# Altium schematic sheet voltage_sense.SchDoc
size A4; Author: Mikołaj Pichita; CompanyName: AGH University of Science and Technology; SheetNumber: 14; SheetTotal: 16
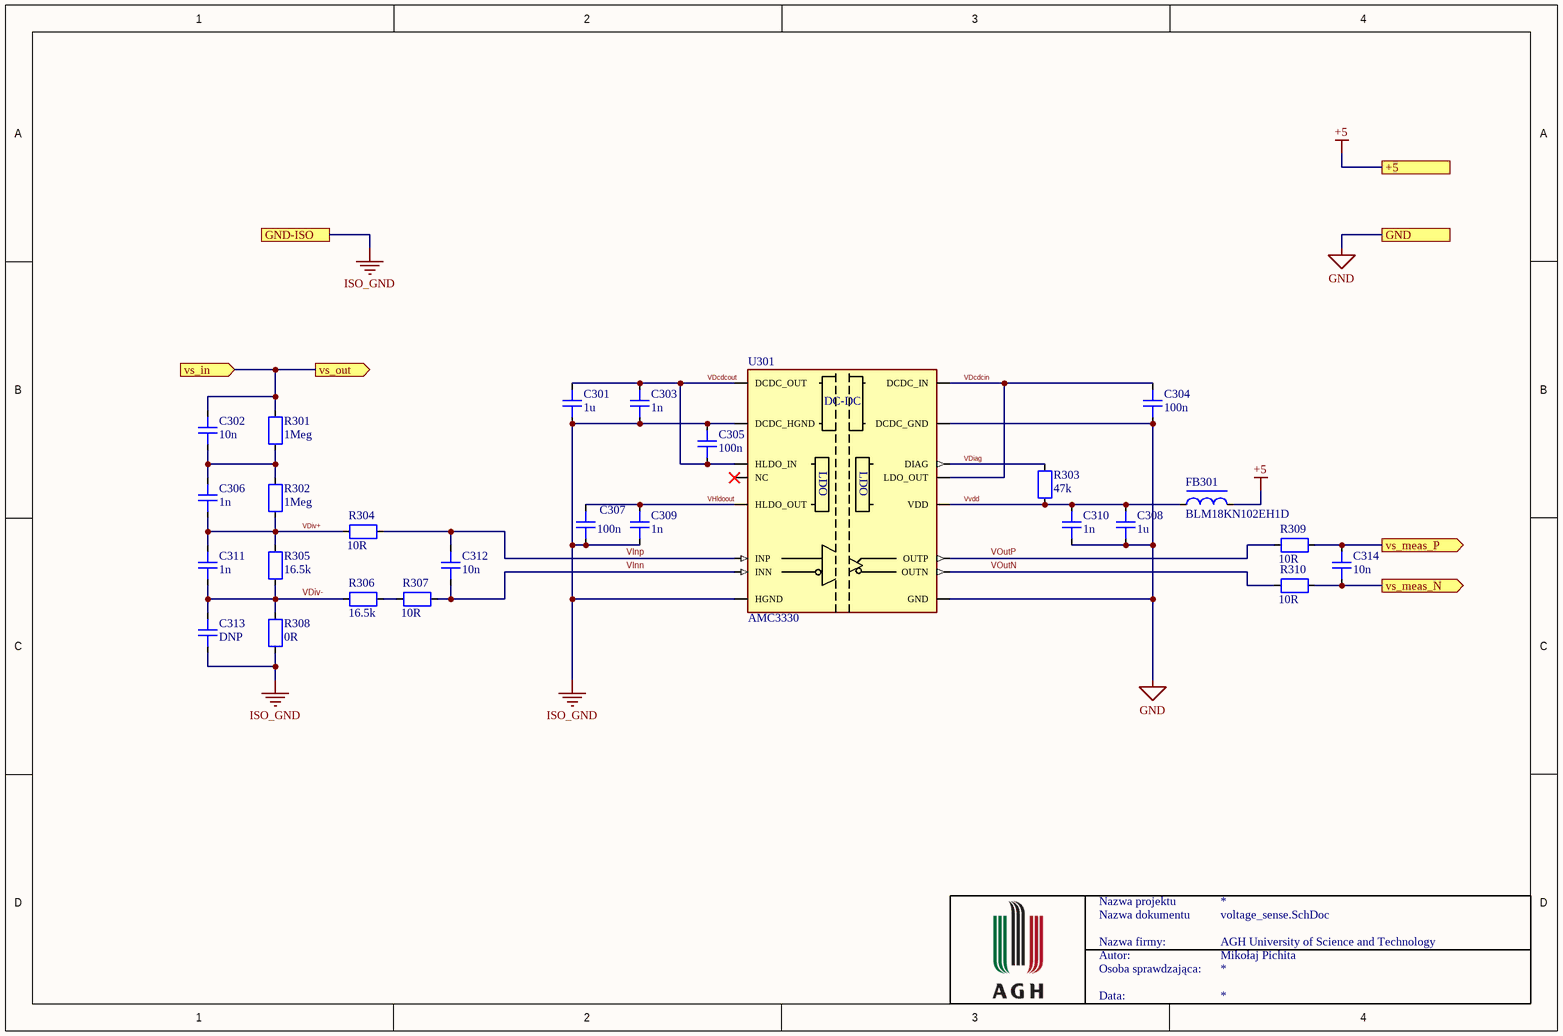
[diagram p0: voltage_sense.SchDoc]

## Parts
C301  1u  [CAP1206]
C302  10n  [CAP0603]
C303  1n  [CAP0603]
C304  100n  [CAP0603]
C305  100n  [CAP0603]
C306  1n  [CAP0603]
C307  100n  [CAP0603]
C308  1u  [CAP1206]
C309  1n  [CAP0603]
C310  1n  [CAP1206]
C311  1n  [CAP0603]
C312  10n  [CAP0603]
C313  DNP  [CAP0603]  (no BOM)
C314  10n  [CAP0603]
FB301  BLM18KN102EH1D  [RES0603]
R301  1Meg  [RES0603]
R302  1Meg  [RES0603]
R303  47k  [RES0603]
R304  10R  [RES0603]
R305  16.5k  [RES0603]
R306  16.5k  [RES0603]
R307  10R  [RES0603]
R308  0R  [RES0603]
R309  10R  [RES0603]
R310  10R  [RES0603]
U301  AMC3330  [SOIC127P1030X265-16N]

## Ports
+5 (see measurements[2C], choke_current_meas[4B], current_sense_shunt[4A], full_bridge[1C], isolator[1B], measurements[1C], microcontroller[1C], power_supply[2B]), GND (see measurements[2C], choke_current_meas[4B], current_sense_shunt[4A], full_bridge[1D], isolator[1B], measurements[1C], microcontroller[1C], power_supply[1B]), GND-ISO (see measurements[2B], full_bridge[1B], input_filter[2C], isolator[4B], measurements[1B], output_filter[1B], OV_OC[1B], power_supply[3B], testpoint[1A]), vs_in (in, see measurements[2B]), vs_meas_N (out, see measurements[3C], measurements[3D]), vs_meas_P (out, see measurements[3C], measurements[3D]), vs_out (out, see measurements[3B])

## Nets
+5: FB301.1 ; port +5
GND: C304.2 C308.2 C310.2 U301.9(GND) U301.15(DCDC_GND) ; port GND
ISO_GND: C301.2 C303.2 C305.1 C307.2 C309.2 C313.2 R308.2 U301.2(DCDC_HGND) U301.8(HGND) ; port GND-ISO
VDcdcin: C304.1 U301.13(LDO_OUT) U301.16(DCDC_IN)
VDcdcout: C301.1 C303.1 C305.2 U301.1(DCDC_OUT) U301.3(HLDO_IN)
VDiag: R303.1 U301.14(DIAG)
VDiv+: C306.2 C311.1 R302.2 R304.2 R305.1
VDiv-: C311.2 C313.1 R305.2 R306.1 R308.1
VHldoout: C307.1 C309.1 U301.5(HLDO_OUT)
VInn: C312.1 R307.1 U301.7(INN)
VInp: C312.2 R304.1 U301.6(INP)
VOutN: R310.2 U301.10(OUTN)
VOutP: R309.2 U301.11(OUTP)
vs_in: C302.1 R301.1 ; port vs_in, port vs_out
vs_meas_N: C314.1 R310.1 ; port vs_meas_N
vs_meas_P: C314.2 R309.1 ; port vs_meas_P
Vvdd: C308.1 C310.1 FB301.2 R303.2 U301.12(VDD)
NetC302_2: C302.2 C306.1 R301.2 R302.1
NetR306_2: R306.2 R307.2

Not connected (* = marked no-connect by the designer): U301 4(NC)*

## Notes on the sheet
- Nazwa projektu
- Nazwa dokumentu
- Nazwa firmy:
- Autor:
- Osoba sprawdzająca:
- Data:
- (in symbol AMC3330) DC-DC; LDO

## Library data of the parts
C301-C314 = Capacitor: Value: *; HelpURL: *; MPN: *; Supplier: *; SupplierPartNumber: *
  C301 C308: Supplier 1: Mouser; Supplier Part Number 1: 581-12065C105K4Z4A
  C303 C309: Supplier 1: Mouser; Supplier Part Number 1: 581-0603YC102J4T2A
  C304 C305 C307: Supplier 1: Mouser; Supplier Part Number 1: 581-06035C104KAT2A
  C310: Supplier 1: Mouser; Supplier Part Number 1: 581-1206GC102KAT3A
  C312 C314: Supplier 1: Mouser; Supplier Part Number 1: 581-06035C103K
FB301 = Ferrite Bead: Value: *; HelpURL: *; MPN: *; Supplier: *; SupplierPartNumber: *; Supplier 1: Mouser; Supplier Part Number 1: 81-BLM18KN102EH1D
R301-R310 = Resistor: Value: *; HelpURL: *; MPN: *; Supplier: *; SupplierPartNumber: *; Supplier 1: Mouser
  R301 R302 R308: Supplier Part Number 1: 667-ERJ-UP3F1004V
  R303: Supplier Part Number 1: 603-RP0603BRD0747KL
  R304 R307 R309 R310: Supplier Part Number 1: 603-RP0603BRD0710RL
  R305 R306: Supplier Part Number 1: 603-RT0603DRE0716K5L
U301 = AMC3330: ±1-V input, precision voltage sensing reinforced isolated amplifier with integrated DC/DC; Value: *; HelpURL: *; MPN: *; Supplier: *; SupplierPartNumber: *